# EAGLE design Schematics (EAGLE 9.6.2)
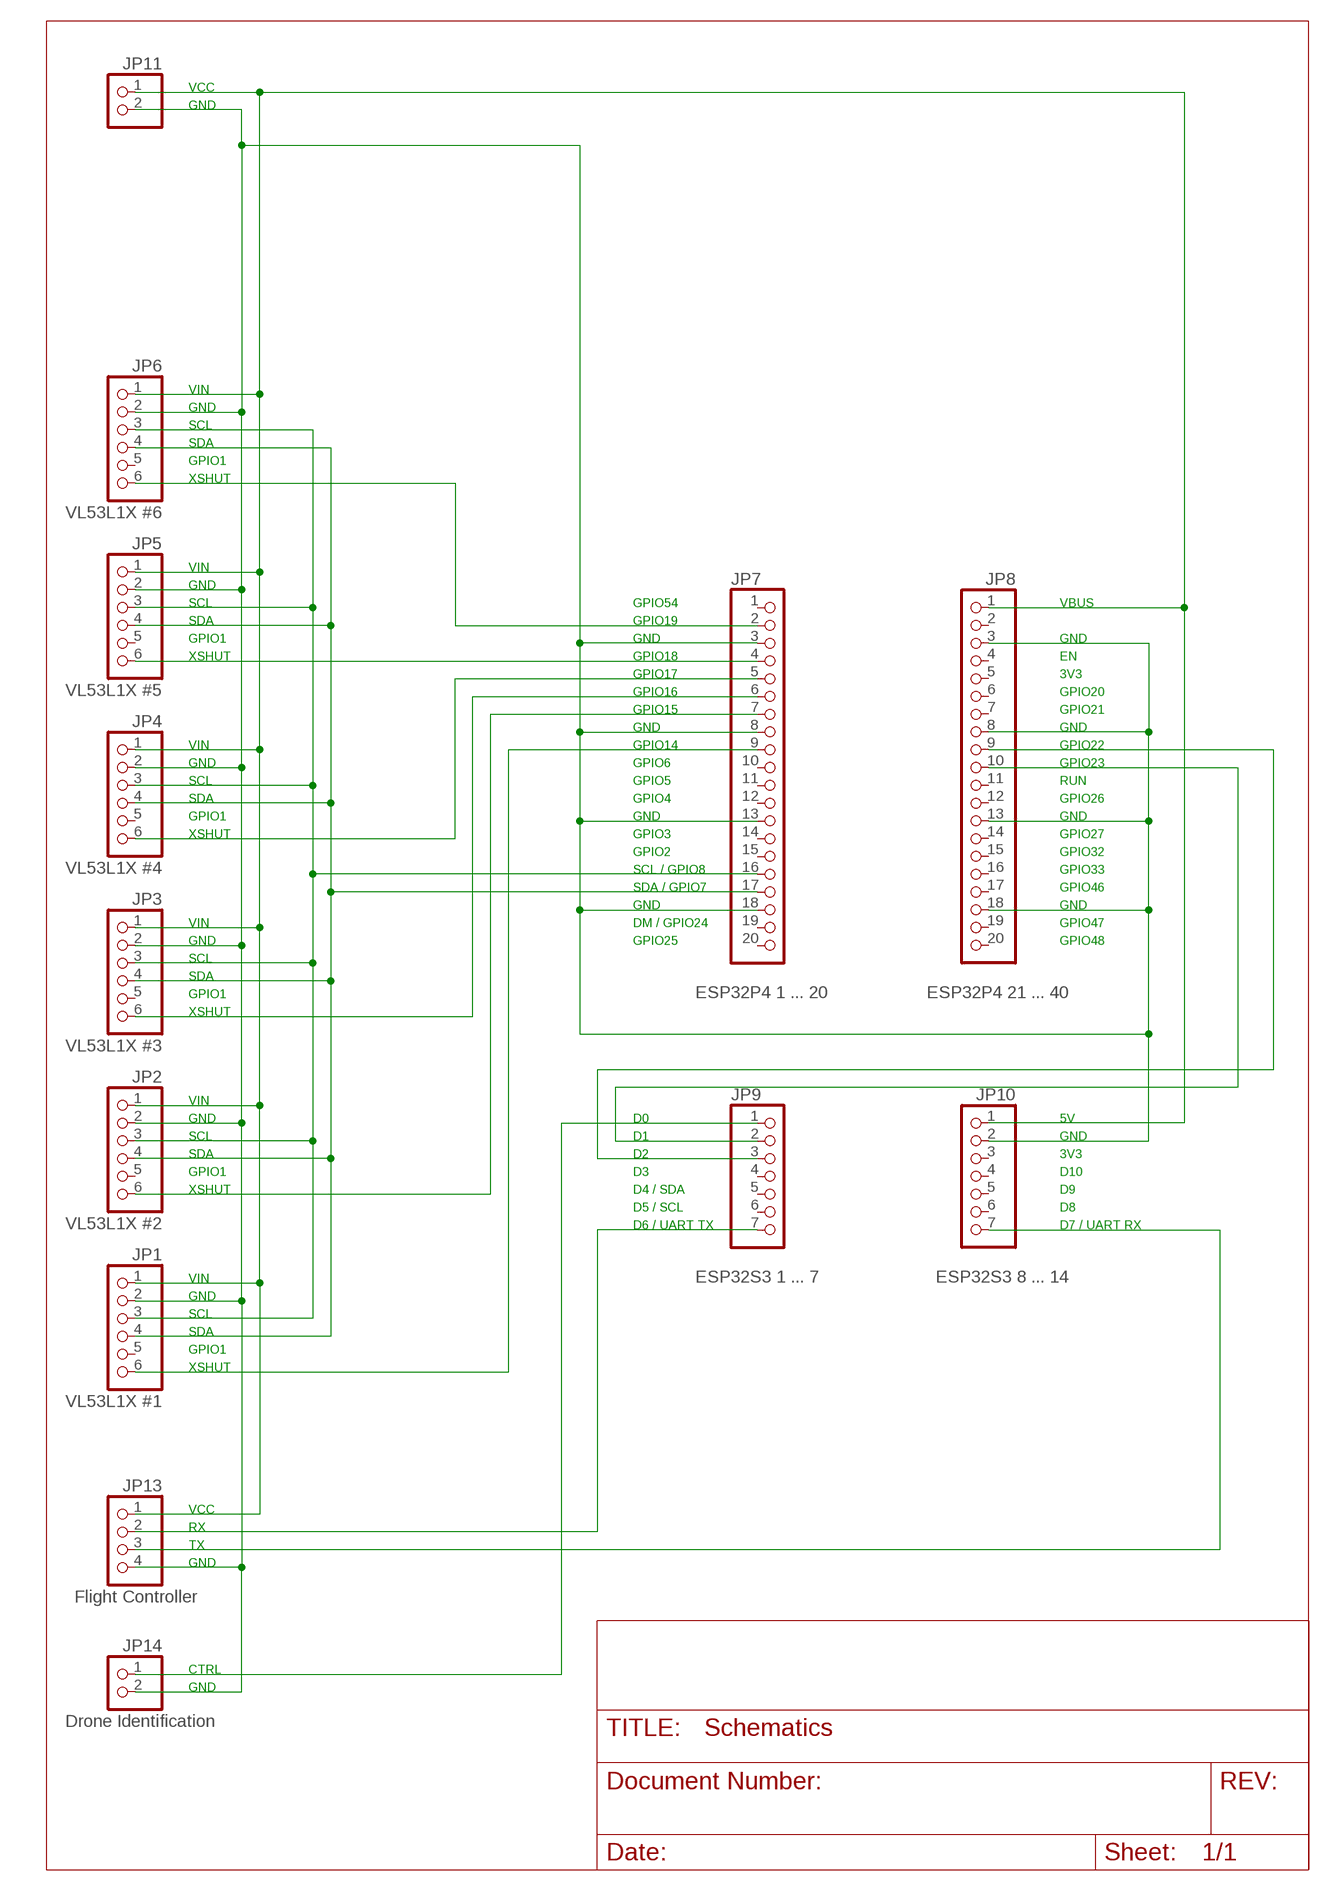
[diagram p0: schematic, sheet 1]

## Parts
JP1  VL53L1X #1  PINHD-1X6  [1X06]
JP2  VL53L1X #2  PINHD-1X6  [1X06]
JP3  VL53L1X #3  PINHD-1X6  [1X06]
JP4  VL53L1X #4  PINHD-1X6  [1X06]
JP5  VL53L1X #5  PINHD-1X6  [1X06]
JP6  VL53L1X #6  PINHD-1X6  [1X06]
JP7  ESP32P4 1 ... 20  PINHD-1X20  [1X20]
JP8  ESP32P4 21 ... 40  PINHD-1X20  [1X20]
JP9  ESP32S3 1 ... 7  PINHD-1X7  [1X07]
JP10  ESP32S3 8 ... 14  PINHD-1X7  [1X07]
JP11  PINHD-1X2  [1X02]
JP13  Flight Controller  PINHD-1X4  [1X04]
JP14  Drone Identification  PINHD-1X2  [1X02]

## Nets
5VDC: JP1.1 JP2.1 JP3.1 JP4.1 JP5.1 JP6.1 JP8.1 JP10.1 JP11.1 JP13.1
GND: JP1.2 JP2.2 JP3.2 JP4.2 JP5.2 JP6.2 JP7.3 JP7.8 JP7.13 JP7.18 JP8.3 JP8.8 JP8.13 JP8.18 JP10.2 JP11.2 JP13.4 JP14.2
LED_CTRL: JP9.1 JP14.1
MASTER_RX: JP8.10 JP9.2
MASTER_TX: JP8.9 JP9.3
MAVLINK_RX: JP10.7 JP13.3
MAVLINK_TX: JP9.7 JP13.2
SCL: JP1.3 JP2.3 JP3.3 JP4.3 JP5.3 JP6.3 JP7.16
SDA: JP1.4 JP2.4 JP3.4 JP4.4 JP5.4 JP6.4 JP7.17
XSHUT1: JP1.6 JP7.9
XSHUT2: JP2.6 JP7.7
XSHUT3: JP3.6 JP7.6
XSHUT4: JP4.6 JP7.5
XSHUT5: JP5.6 JP7.4
XSHUT6: JP6.6 JP7.2
Unconnected: JP1.5 JP2.5 JP3.5 JP4.5 JP5.5 JP6.5 JP7.1 JP7.10 JP7.11 JP7.12 JP7.14 JP7.15 JP7.19 JP7.20 JP8.2 JP8.4 JP8.5 JP8.6 JP8.7 JP8.11 JP8.12 JP8.14 JP8.15 JP8.16 JP8.17 JP8.19 JP8.20 JP9.4 JP9.5 JP9.6 JP10.3 JP10.4 JP10.5 JP10.6

## Notes on the sheet
- VCC
- GND
- VIN
- GND
- SCL
- SDA
- GPIO1
- XSHUT
- VIN
- GND
- SCL | GPIO54 | VBUS
- SDA | GPIO19
- GPIO1 | GND | GND
- XSHUT | GPIO18 | EN
- GPIO17 | 3V3
- GPIO16 | GPIO20
- GPIO15 | GPIO21
- GND | GND
- VIN | GPIO14 | GPIO22
- GND | GPIO6 | GPIO23
- SCL | GPIO5 | RUN
- SDA | GPIO4 | GPIO26
- GPIO1 | GND | GND
- XSHUT | GPIO3 | GPIO27
- GPIO2 | GPIO32
- SCL / GPIO8 | GPIO33
- SDA / GPIO7 | GPIO46
- GND | GND
- VIN | DM / GPIO24 | GPIO47
- GND | GPIO25 | GPIO48
- SCL
- SDA
- GPIO1
- XSHUT
- VIN
- GND | D0 | 5V
- SCL | D1 | GND
- SDA | D2 | 3V3
- GPIO1 | D3 | D10
- XSHUT | D4 / SDA | D9
- D5 / SCL | D8
- D6 / UART TX | D7 / UART RX
- VIN
- GND
- SCL
- SDA
- GPIO1
- XSHUT
- VCC
- RX
- TX
- GND
- CTRL
- GND

## Library data of the parts
JP1-JP6 = pinhead:PINHD-1X6: PIN HEADER
JP7 JP8 = adafruit:PINHD-1X20: PIN HEADER
JP9 JP10 = pinhead:PINHD-1X7: PIN HEADER
JP11 JP14 = pinhead:PINHD-1X2: PIN HEADER
JP13 = pinhead:PINHD-1X4: PIN HEADER

## Board
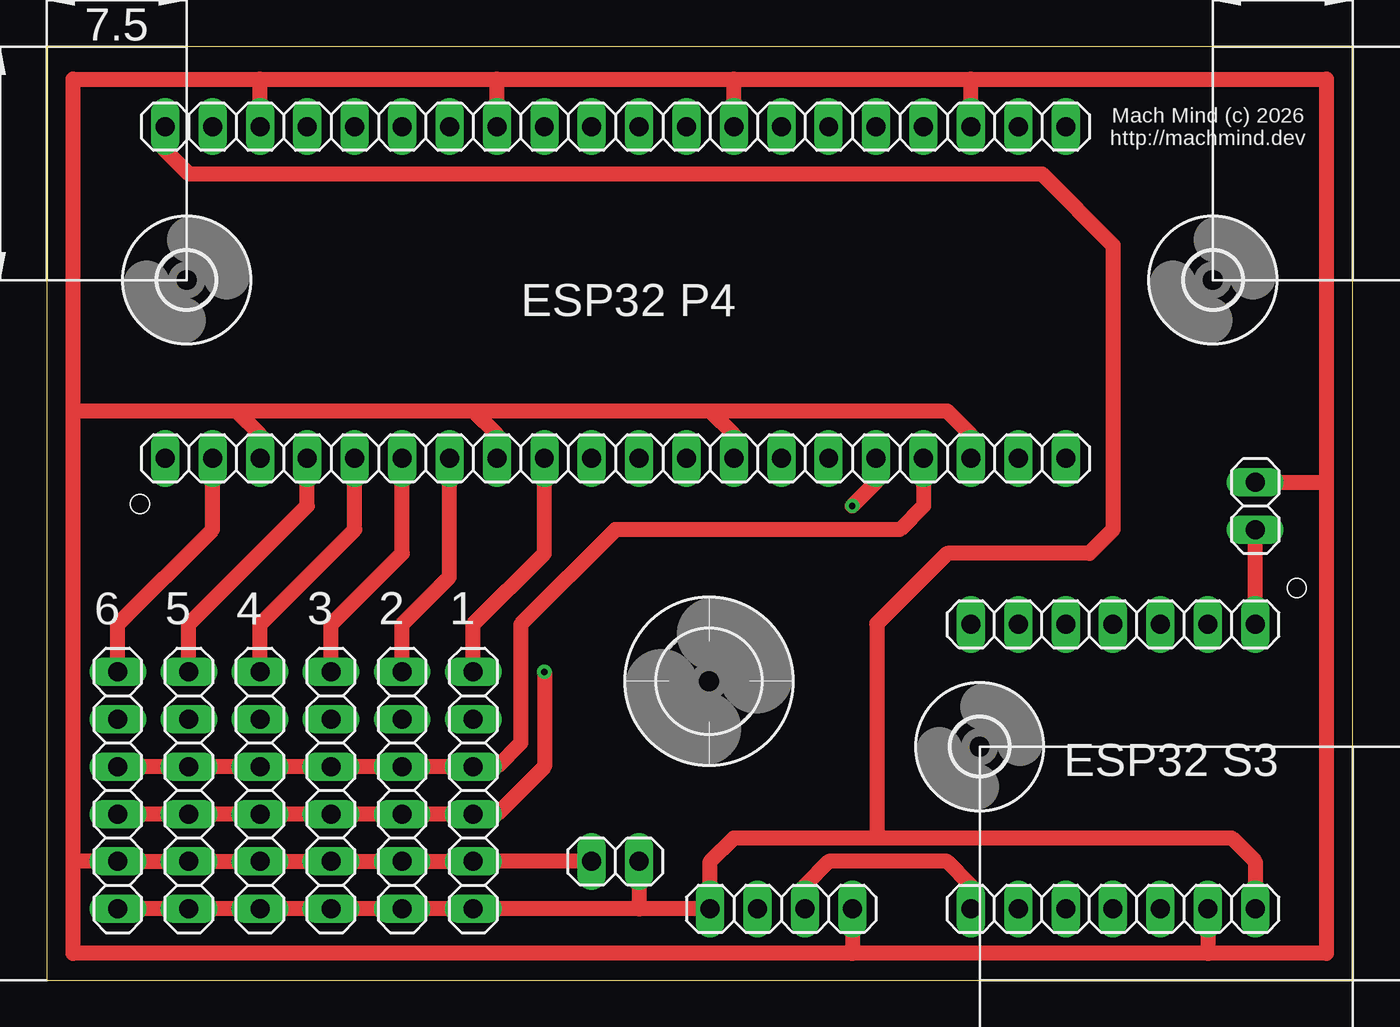
[diagram p1: board, top side]
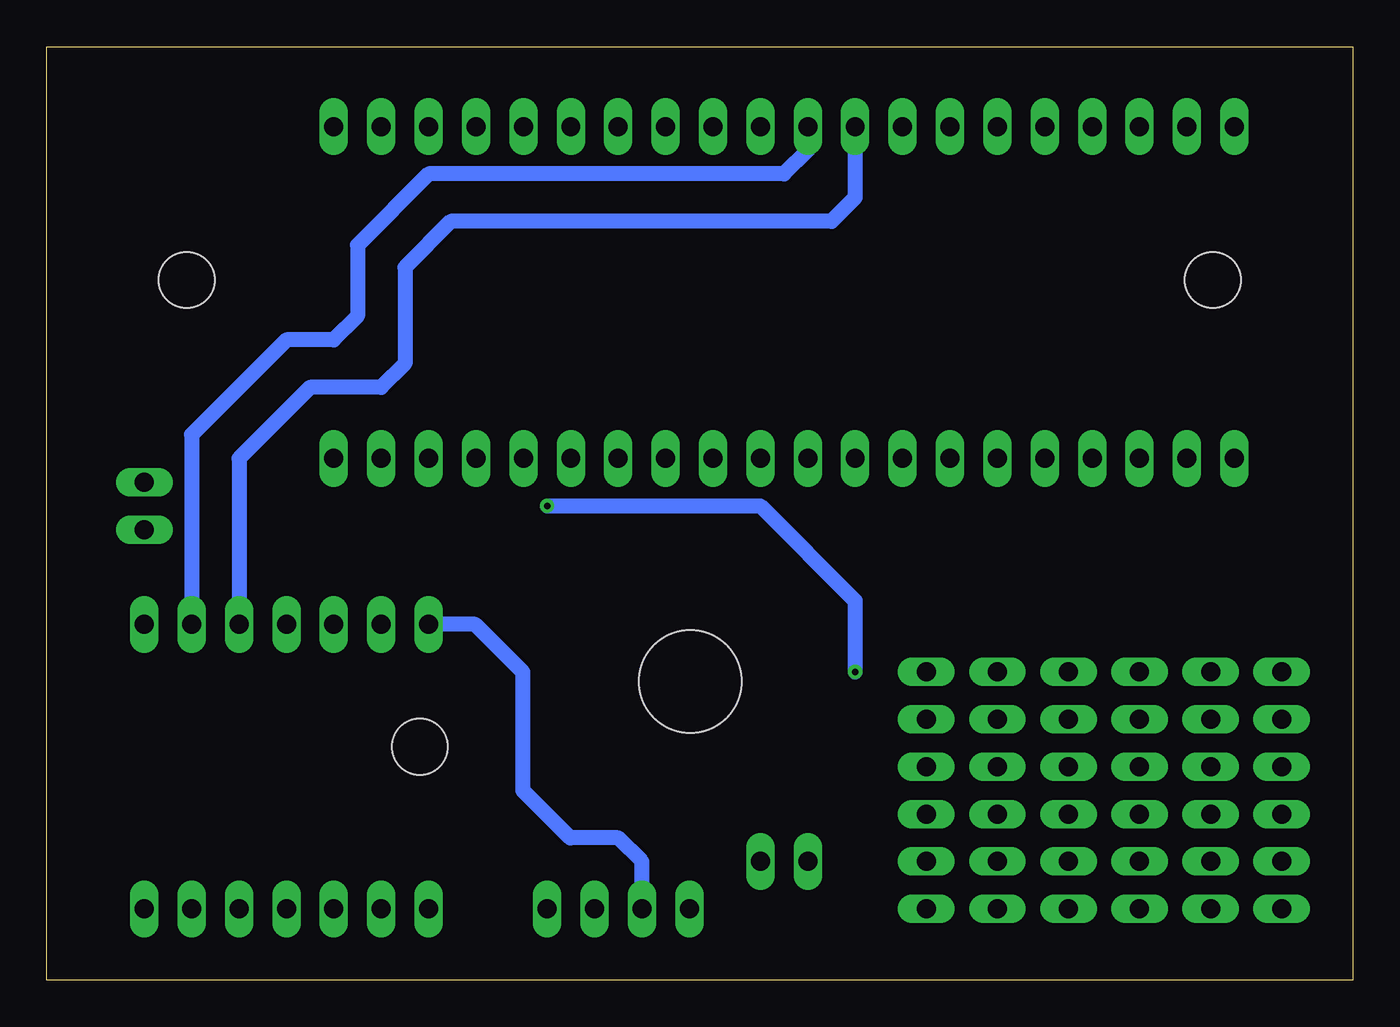
[diagram p2: board, bottom side, seen from below]

Size 70 x 50 mm. Coordinates in mm from the lower left corner, seen from the top.
Outline: 0,0 70,0 70,50 0,50 0,0
Copper layers (1*16): Top 0.035mm / dielectric 1.5mm / Bottom 0.035mm
Design rules "default": minimum track width 6mil, minimum drill 0.35mm, track to track 6mil, track to pad 6mil, pad to pad 6mil, via to via 6mil, smd to smd 6mil, copper to edge 40mil, drill to drill 6mil, minimum pad ring 10mil, minimum via ring 8mil, stop-mask expansion 4mil, vias tented up to drill 0mil, thermal gap 10mil

### Footprints (pad centres in the part's own frame; a part is rotated, then mirrored left to right if it is on the bottom)
1X06 = drill 1.016 long: 1 -6.35,0; 2 -3.81,0; 3 -1.27,0; 4 1.27,0; 5 3.81,0; 6 6.35,0
1X20 = drill 1.016 long: 1 -24.13,0; 2 -21.59,0; 3 -19.05,0; 4 -16.51,0; 5 -13.97,0; 6 -11.43,0; 7 -8.89,0; 8 -6.35,0; 9 -3.81,0; 10 -1.27,0; 11 1.27,0; 12 3.81,0; 13 6.35,0; 14 8.89,0; 15 11.43,0; 16 13.97,0; 17 16.51,0; 18 19.05,0; 19 21.59,0; 20 24.13,0
1X07 = drill 1.016 long: 1 -7.62,0; 2 -5.08,0; 3 -2.54,0; 4 0,0; 5 2.54,0; 6 5.08,0; 7 7.62,0
1X02 = drill 1.016 long: 1 -1.27,0; 2 1.27,0
1X04 = drill 1.016 long: 1 -3.81,0; 2 -1.27,0; 3 1.27,0; 4 3.81,0
3,0 = hole 3: 0,0
5,5 = hole 5.5: 0,0

### Placement (x,y rotation side)
JP1  22.86,10.16 90 top
JP2  19.05,10.16 90 top
JP3  15.24,10.16 90 top
JP4  11.43,10.16 90 top
JP5  7.62,10.16 90 top
JP6  3.81,10.16 90 top
JP7  30.48,27.94 0 top
JP8  30.48,45.72 0 top
JP9  57.15,19.05 180 top
JP10  57.15,3.81 180 top
JP11  30.48,6.35 180 top
JP13  39.37,3.81 0 top
JP14  64.77,25.4 90 top
U$1  [3,0]  7.5,37.5 0 top
U$2  [3,0]  62.5,37.5 0 top
U$3  [3,0]  50,12.5 0 top
U$4  [5,5]  35.5,16 0 top

### Tracks (layer width: path | path; a pad name or v marks a point on that pad's centre or on a via)
5VDC
  Top 0.813: JP8.1 6.35,44.45 7.62,43.18 53.34,43.18 57.15,39.37 57.15,24.13 55.88,22.86 48.26,22.86 44.49,19.09 44.49,7.62 | JP10.1 64.77,6.35 63.5,7.62 44.49,7.62 | 31.75,3.81 JP13.1 35.56,6.35 36.83,7.62 44.49,7.62 | 31.75,3.81 JP1.1 JP2.1 JP3.1 JP4.1 JP5.1 JP6.1 | JP11.1 31.75,3.81
GND
  Top 0.813: 1.42,6.35 JP6.2 JP5.2 JP4.2 JP3.2 JP2.2 JP1.2 JP11.2 | 1.42,6.35 1.42,30.48 | 1.42,30.48 1.42,48.26 11.43,48.26 | 11.43,48.26 24.13,48.26 | 24.13,48.26 36.83,48.26 | 36.83,48.26 49.53,48.26 | 49.53,48.26 68.58,48.26 68.58,26.67 | 1.42,6.35 1.42,1.42 43.18,1.42 | 68.58,26.67 68.58,1.42 62.23,1.42 | 62.23,1.42 43.18,1.42 | JP14.2 68.58,26.67 | JP10.2 62.23,1.42 | JP13.4 43.18,1.42 | JP8.3 11.43,48.26 | JP8.8 24.13,48.26 | JP8.13 36.83,48.26 | JP8.18 49.53,48.26 | JP7.3 11.43,29.21 10.16,30.48 | 10.16,30.48 1.42,30.48 | JP7.8 24.13,29.21 22.86,30.48 | 22.86,30.48 10.16,30.48 | JP7.13 36.83,29.21 35.56,30.48 | 35.56,30.48 22.86,30.48 | JP7.18 49.53,29.21 48.26,30.48 35.56,30.48
LED_CTRL
  Top 0.813: JP9.1 JP14.1
MASTER_RX
  Bottom 0.813: JP8.10 29.21,44.45 30.48,43.18 49.53,43.18 53.34,39.37 53.34,35.56 54.61,34.29 57.15,34.29 62.23,29.21 JP9.2
MASTER_TX
  Bottom 0.813: JP8.9 26.67,41.91 27.94,40.64 48.34,40.64 50.8,38.18 50.8,33.02 52.07,31.75 55.88,31.75 59.69,27.94 JP9.3
MAVLINK_RX
  Top 0.813: JP10.7 49.53,5.08 48.26,6.35 41.91,6.35 40.64,5.08 JP13.3
MAVLINK_TX
  Bottom 0.813: JP13.2 38.1,6.35 39.37,7.62 41.95,7.62 44.49,10.16 44.49,16.51 47.03,19.05 JP9.7
SCL  (via drill 0.35)
  Top 0.813: JP7.16 44.45,26.67 v43.18,25.4 | v26.67,16.51 26.67,11.43 24.13,8.89 JP1.3 JP2.3 JP3.3 JP4.3 JP5.3 JP6.3
  Bottom 0.813: v43.18,25.4 31.75,25.4 26.67,20.32 v26.67,16.51
SDA
  Top 0.813: JP7.17 46.99,25.4 45.72,24.13 30.48,24.13 25.4,19.05 25.4,12.7 24.13,11.43 JP1.4 JP2.4 JP3.4 JP4.4 JP5.4 JP6.4
XSHUT1
  Top 0.813: JP1.6 22.86,19.05 26.67,22.86 JP7.9
XSHUT2
  Top 0.813: JP2.6 19.05,19.05 21.59,21.59 JP7.7
XSHUT3
  Top 0.813: JP3.6 15.24,19.05 19.05,22.86 JP7.6
XSHUT4
  Top 0.813: JP4.6 11.43,19.05 16.51,24.13 JP7.5
XSHUT5
  Top 0.813: JP5.6 7.62,19.05 13.97,25.4 JP7.4
XSHUT6
  Top 0.813: JP6.6 3.81,19.05 8.89,24.13 JP7.2

### Text on the board
tPlace: ESP32 P4 | 6 | 5 | 4 | 3 | 2 | 1 | ESP32 S3
tNames: Mach Mind (c) 2026 / http://machmind.dev